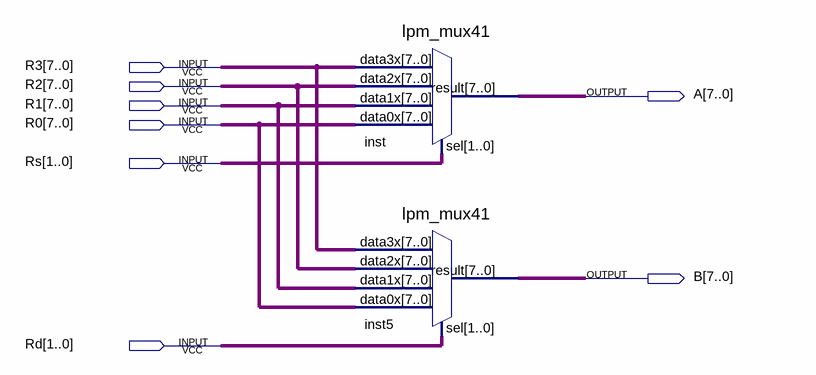
[diagram p0: schematic sheet]
// Quartus schematic mux41.bdf as structural Verilog: 2 symbols, 8 pins
module mux41 (
  input  [7:0] R3,
  input  [7:0] R2,
  input  [7:0] R1,
  input  [7:0] R0,
  input  [1:0] Rs,
  input  [1:0] Rd,
  output [7:0] A,
  output [7:0] B
);

  lpm_mux41 inst (.data3x(R3), .data2x(R2), .data1x(R1), .data0x(R0), .sel(Rs), .result(A));
  lpm_mux41 inst5 (.data3x(R3), .data2x(R2), .data1x(R1), .data0x(R0), .sel(Rd), .result(B));
endmodule
